# EAGLE design extruder-board (EAGLE 9.6.2)

## Sheet 1 of 2
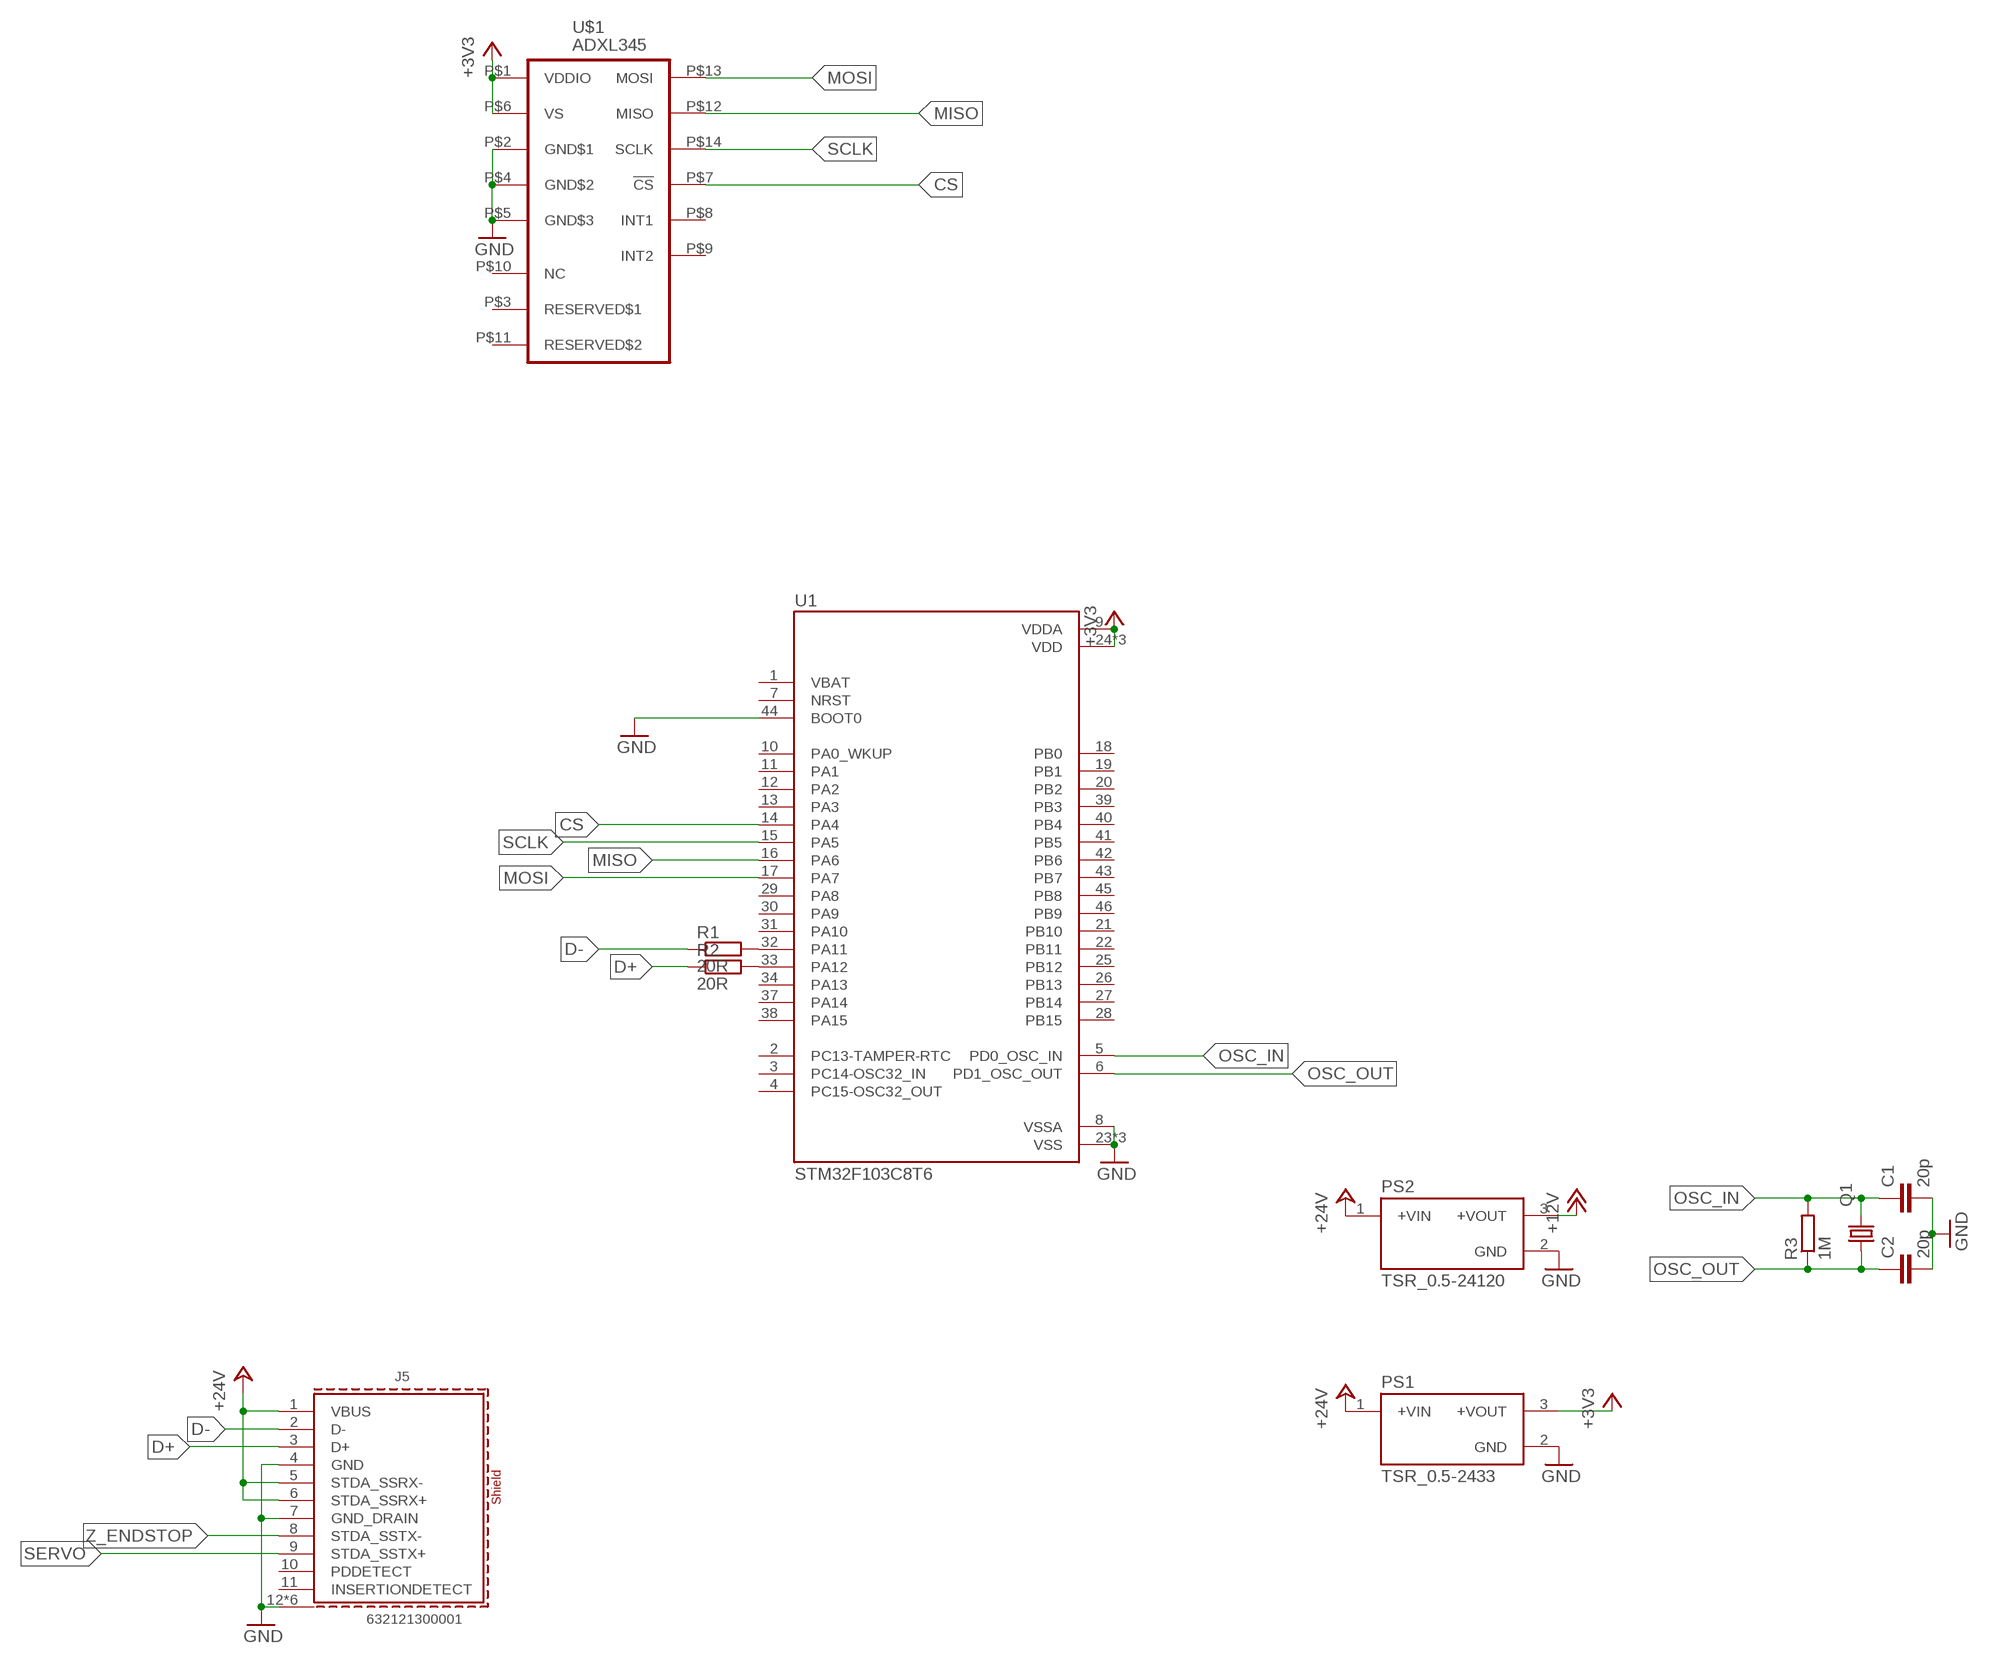
[diagram p0: schematic, sheet 1]

### Parts
C1  20p  C-EUC0805  [C0805]
C2  20p  C-EUC0805  [C0805]
J5  632121300001  [632121300001]
PS1  TSR_0.5-2433  [CONV_TSR_0.5-2433]
PS2  TSR_0.5-24120  TSR_0.5-2433  [CONV_TSR_0.5-2433]
Q1  KX-9A  [5.0X3.2_KX-9A]
R1  20R  R-EU_R0805  [R0805]
R2  20R  R-EU_R0805  [R0805]
R3  1M  R-EU_R0805  [R0805]
U1  STM32F103C8T6  [QFP50P900X900X160-48N]
U$1  ADXL345  [LGA14]

### Nets
+3V3: PS1.3(+VOUT) U1.9(VDDA) U1.24(VDD) U1.36(VDD) U1.48(VDD) U$1.P$1(VDDIO) U$1.P$6(VS)
+12V: PS2.3(+VOUT)
+24V: J5.1(VBUS) J5.5(STDA_SSRX-) J5.6(STDA_SSRX+) PS1.1(+VIN) PS2.1(+VIN)
CS: U1.14(PA4) U$1.P$7(!CS)
D+: J5.3(D+) R2.1
D-: J5.2(D-) R1.1
GND: C1.2 C2.2 J5.4(GND) J5.7(GND_DRAIN) J5.12(SHIELD) J5.13(SHIELD) J5.S1(SHIELD) J5.S2(SHIELD) J5.S3(SHIELD) J5.S4(SHIELD) PS1.2(GND) PS2.2(GND) U1.8(VSSA) U1.23(VSS) U1.35(VSS) U1.44(BOOT0) U1.47(VSS) U$1.P$2(GND$1) U$1.P$4(GND$2) U$1.P$5(GND$3)
MISO: U1.16(PA6) U$1.P$12(MISO)
MOSI: U1.17(PA7) U$1.P$13(MOSI)
N$1: R1.2 U1.32(PA11)
N$2: R2.2 U1.33(PA12)
OSC_IN: C1.1 Q1.3 R3.2 U1.5(PD0_OSC_IN)
OSC_OUT: C2.1 Q1.1 R3.1 U1.6(PD1_OSC_OUT)
SCLK: U1.15(PA5) U$1.P$14(SCLK)
SERVO: J5.9(STDA_SSTX+)
Z_ENDSTOP: J5.8(STDA_SSTX-)
Unconnected: J5.10(PDDETECT) J5.11(INSERTIONDETECT) U1.1(VBAT) U1.2(PC13-TAMPER-RTC) U1.3(PC14-OSC32_IN) U1.4(PC15-OSC32_OUT) U1.7(NRST) U1.10(PA0_WKUP) U1.11(PA1) U1.12(PA2) U1.13(PA3) U1.18(PB0) U1.19(PB1) U1.20(PB2) U1.21(PB10) U1.22(PB11) U1.25(PB12) U1.26(PB13) U1.27(PB14) U1.28(PB15) U1.29(PA8) U1.30(PA9) U1.31(PA10) U1.34(PA13) U1.37(PA14) U1.38(PA15) U1.39(PB3) U1.40(PB4) U1.41(PB5) U1.42(PB6) U1.43(PB7) U1.45(PB8) U1.46(PB9) U$1.P$3(RESERVED$1) U$1.P$8(INT1) U$1.P$9(INT2) U$1.P$10(NC) U$1.P$11(RESERVED$2)

## Sheet 2 of 2
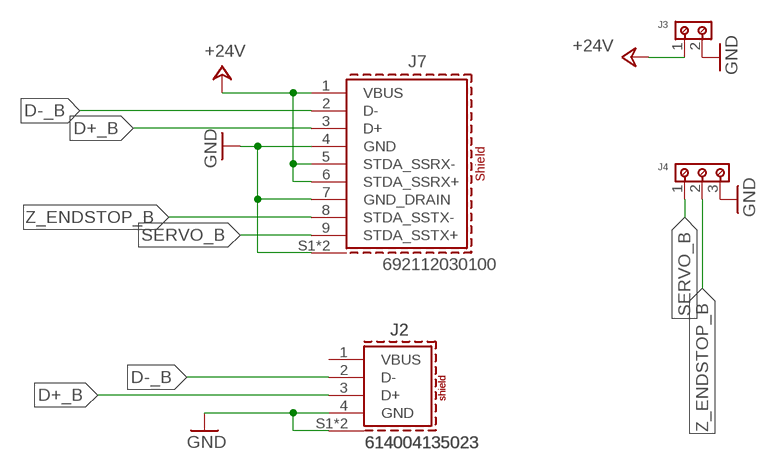
[diagram p1: schematic, sheet 2]

### Parts
J2  614004135023  [614004135023]
J3  691103110002  [691103110002]
J4  691103110003  [691103110003]
J7  692112030100  [692112030100]

### Nets
+24V_B: J3.1 J7.1(VBUS) J7.5(STDA_SSRX-) J7.6(STDA_SSRX+) ; supply symbol labelled +24V
D+_B: J2.3(D+) J7.3(D+)
D-_B: J2.2(D-) J7.2(D-)
GND_B: J2.4(GND) J2.S1(SHIELD) J2.S2(SHIELD) J3.2 J4.3 J7.4(GND) J7.7(GND_DRAIN) J7.S1(SHIELD) J7.S2(SHIELD) ; supply symbol labelled GND
SERVO_B: J4.1 J7.9(STDA_SSTX+)
Z_ENDSTOP_B: J4.2 J7.8(STDA_SSTX-)
Unconnected: J2.1(VBUS)

## Library data of the parts
C1 C2 = rcl:C-EU: CAPACITOR, European symbol; SPICEPREFIX: C
J2 = Eagle_WR-USB (rev21c):614004135023: WR-COM USB 2.0 Type A Vertical Kind Properties Durability:1500 Mating cycles Quality Class:1 500 Mating cycles Connector Type:USB Gender:Receptacle Type:Vertical General Information Operating Temperature:-40up to +105 °C Compliance:RoHS Electrical Properties IR 1:1.5 A Working Voltage:30V (AC) Withstanding Voltage:750V (AC) Contact Resistance:20 mΩ Material Properties Insulator Material:PBT Insulator Flammability Rating:UL94 V-0 Color:White Cover Material:Brass Cover Plating:Nickel Contact Material:Copper Alloy Contact Plating:Selective Gold Contact Type:Stamped Shielding Material:Brass Shielding Plating:Nickel <https://www.we-online.com/catalog/media/o32979v209%20Family_WR-COM_614004135023.jpg> Details see: https://www.we-online.com/catalog/en/COM_TYPE_A_VERTICAL/ Updated by Yingchun, Shan 2020-01-15 2020 (C) Würth Elektronik; APPLICATION: USB 2.0; DATASHEET-URL: https://www.we-online.com/catalog/datasheet/614004135023.pdf; GERDER: Receptacle; INTERFACE-TYPE: Type A; IR1: 1.5A; MOUNT: THT; PACKAGING: Tray; PART-NUMBER: 614004135023; PINS: 4; TYPE: Vertical; WORKING-VOLTAGE: 30V(AC)
J3 = Eagle_WR-TBL Wire Protector (rev20a):691103110002: WR-TBL Serie 1031 - 3.50 mm Horiz. Entry Modular KIND PROPERTIES Pitch 3.5 mm MATERIAL PROPERTIES Insulator Material PA66 Insulator Flammability Rating UL94 V-0 Insulator Color Blue Contact Material Brass Contact Plating Copper over Zinc Terminal Screw Material Steel Terminal Screw Plating Zinc Wire Guard Material Stainless Steel GENERAL INFORMATION Operating Temperature -40 up to +105 °C Compliance Lead free / RoHS ELECTRICAL PROPERTIES IR UL 10 A Working Voltage [UL] 125 V (AC) Withstanding Voltage [UL] 1250 V (AC) Contact Resistance 20 mΩ Contact Resistance [UL] 20 mΩ MECHANICAL PROPERTIES Wire Strip Length 5 up to 6 (mm) Screw M2 Solid Wire Section (AWG) 26 to 16 (AWG) Solid Wire Section (Metric) 0.129 to 1.31 (mm²) Stranded Wire Section (AWG) 26 to 16 (AWG) Stranded Wire Section (Metric) 0.129 to 1.31 (mm²) CERTIFICATION UL Approval E315414 PACKAGING PROPERTIES Packaging Box <https://katalog.we-online.com/media/images/v2/o33226v209%20Family_WR-TBL_69110311000x.jpg> Details see: https://katalog.we-online.com/en/em/TBL_3_50_1031_6911031100XX Updated by Ella Wu 2019-11-07 2019(C) Wurth Elektronik; DATASHEET-URL: https://www.we-online.com/catalog/datasheet/691103110002.pdf; IR-UL: 10A; MOUNT: THT; PART-NUMBER: 691103110002; PINS: 2; PITCH: 3.5mm; TYPE: Horizontal; WIRE: 26 to 16 (AWG) 0.129 to 1.31 (mm²); WORKING-VOLTAGE-UL: 125V(AC)
J4 = Eagle_WR-TBL Wire Protector (rev20a):691103110003: WR-TBL Serie 1031 - 3.50 mm Horiz. Entry Modular KIND PROPERTIES Pitch 3.5 mm MATERIAL PROPERTIES Insulator Material PA66 Insulator Flammability Rating UL94 V-0 Insulator Color Blue Contact Material Brass Contact Plating Copper over Zinc Terminal Screw Material Steel Terminal Screw Plating Zinc Wire Guard Material Stainless Steel GENERAL INFORMATION Operating Temperature -40 up to +105 °C Compliance Lead free / RoHS ELECTRICAL PROPERTIES IR UL 10 A Working Voltage [UL] 125 V (AC) Withstanding Voltage [UL] 1250 V (AC) Contact Resistance 20 mΩ Contact Resistance [UL] 20 mΩ MECHANICAL PROPERTIES Wire Strip Length 5 up to 6 (mm) Screw M2 Solid Wire Section (AWG) 26 to 16 (AWG) Solid Wire Section (Metric) 0.129 to 1.31 (mm²) Stranded Wire Section (AWG) 26 to 16 (AWG) Stranded Wire Section (Metric) 0.129 to 1.31 (mm²) CERTIFICATION UL Approval E315414 PACKAGING PROPERTIES Packaging Box <https://katalog.we-online.com/media/images/v2/o33226v209%20Family_WR-TBL_69110311000x.jpg> Details see: https://katalog.we-online.com/en/em/TBL_3_50_1031_6911031100XX Updated by Ella Wu 2019-11-07 2019(C) Wurth Elektronik; DATASHEET-URL: https://www.we-online.com/catalog/datasheet/691103110003.pdf; IR-UL: 10A; MOUNT: THT; PART-NUMBER: 691103110003; PINS: 3; PITCH: 3.5mm; TYPE: Horizontal; WIRE: 26 to 16 (AWG) 0.129 to 1.31 (mm²); WORKING-VOLTAGE-UL: 125V(AC)
J5 = Eagle_WR-USB (rev21c):632121300001: WR-COM USB 3.1 Type C Plug Horizontal 0.8 mm Kind Properties Durability:5 000 Mating cycles Quality Class:5 000 Mating cycles Connector Type:USB Gender:Receptacle Type:Horizontal General Information Operating Temperature:-20up to +85 °C Compliance:RoHS Electrical Properties IR 1:5A Working Voltage:20V (DC) Withstanding Voltage:100V (AC) Contact Resistance:50 mΩ Material Properties Insulator Material:PA9T Insulator Flammability Rating:UL94 V-0 Color:Blue Cover Material:Steel Cover Plating:Matte Tin Contact Material:Copper Alloy Contact Plating:Gold Contact Type:Stamped Shielding Material:Steel Shielding Plating:Matte Tin <https://www.we-online.com/catalog/media/o58978v209%20Family_WR-COM_632121300001_4C.jpg> Details see: https://www.we-online.com/catalog/en/COM_3_1_THT_TYPE_A_RECEPTACLE_HORIZONTAL/ Updated by Ella Wu 2020-08-17 2020 (C) Würth Elektronik; APPLICATION: USB 3.1; DATASHEET-URL: https://www.we-online.com/catalog/datasheet/632121300001.pdf; GERDER: Receptacle; INTERFACE-TYPE: Type A; IR1: 5A; MOUNT: THR; PACKAGING: Tray; PART-NUMBER: 632121300001; PINS: 9; TYPE: Horizontal; WORKING-VOLTAGE: 20V(DC)
J7 = Eagle_WR-USB (rev21c):692112030100: WR-COM USB 3.0 Type A SMT Plug with Clip Kind Properties Durability:5 000 Mating cycles Connector Type:USB Gender:Plug Type:Horizontal General Information Operating Temperature:-20up to +85 °C Compliance:RoHS Electrical Properties IR 1:1.8A Working Voltage:30V (AC) Withstanding Voltage:1000V (AC) Contact Resistance:50 mΩ Material Properties Insulator Material:LCP Insulator Flammability Rating:UL94 V-0 Color:Blue Contact Material:Phosphor Bronze Contact Plating:Matte Tin over Nickel Contact Type:Stamped Shielding Material:Steel Shielding Plating:Tin <https://www.we-online.com/catalog/media/o33019v209%20Family_WR-COM_692112030100.jpg> Details see: https://www.we-online.com/catalog/en/COM_3_0_SMT_TYPE_A_PLUG_WITH_CLIP/ Updated by Yingchun, Shan 2020-01-16 2020 (C) Würth Elektronik; APPLICATION: USB 3.0; DATASHEET-URL: https://www.we-online.com/catalog/datasheet/692112030100.pdf; GERDER: Plug; INTERFACE-TYPE: Type A; IR1: 1.8A; MOUNT: SMT; PACKAGING: Tray; PART-NUMBER: 692112030100; PINS: 9; TYPE: Horizontal; WORKING-VOLTAGE: 30V(AC)
PS1 PS2 = TSR_0.5-2433:TSR_0.5-2433: Check prices <https://pricing.snapeda.com/parts/TSR%200.5-2433/Traco%20Power/view-part?ref=eda>; AVAILABILITY: In Stock; DESCRIPTION: 0.5 Amp POL switching regulator, 4.75 to -32 VDC input, pos.-pos. circuit, LM78 compatible, SIP-3; MF: Traco Power; MP: TSR 0.5-2433; PACKAGE: SIP-3 Traco Power; PRICE: None; PURCHASE-URL: https://pricing.snapeda.com/search/part/TSR 0.5-2433/?ref=eda
Q1 = crystal-geyer_V1_0:KX: Quartz Crystals (MHz) SMD: KX - Serie Model Size l/w/h [mm] Frequency Range Frequency Stability Temp. Range [°C] Load Capacitance AECQ 200 availabel Datasheet KX-4 KX-5 KX-6 KX-7 KX-9A KX-9B KX-12A KX-12B KX-13 KX-20 KX-K KX-KS 1.6/1.2/0.3 2.0/1.6/0.45 2.5/2.0/0.55 3.2/2.5/0.8 5.0/3.2/1.0 5.0/3.2/1.1 6.0/3.5/1.1 6.0/3.5/1.0 7.0/5.0 /1.3 11.6/5.5/1.6 12.3/4.5/4.2 12.3/4.5/3.2 24.0 ~ 80.0 MHz 16.0 ~ 80.0 MHz 12.0 ~ 80.0 MHz 8.0 ~ 60.0 MHz 7,68 ~ 300,0 MHz 8,0 ~ 50,0 MHz 8,0 ~ 150,0 MHz 8,0 ~ 50,0 MHz 6,0 ~ 160,0 MHz 3,579 ~ 25,0 MHz 3,579 ~ 70,0 MHz 3,579 ~ 70,0 MHz ±10 … ±50ppm ±10 … ±50ppm ±10 … ±50ppm ±10 … ±50ppm ±10 … ±50ppm ±10 … ±50ppm ±10 … ±50ppm ±10 … ±50ppm ±10 … ±50ppm ±50ppm ±10 … ±50ppm ±10 … ±50ppm (*) -40°C …+85°C (*) -40°C …+125°C (*) -40°C …+125°C (*) -40°C …+125°C (*) -40°C …+105°C (*) -40°C …+105°C (*) -40°C …+125°C (*) -40°C …+105°C (*) -40°C …+105°C (*) -40°C …+105°C (*) -40°C …+85°C (*) -40°C …+85°C 8, 8…16 8, 8…16 10, 8…16 12, 7…20 16, 10…20 16, 10…20 16, 10…20 16, 12…20 16, 12…20 16, 12…20 16, 12…30 16, 12…30 - yes yes yes - - - - - - - - KX-4.pdf <http://www.geyer-electronic.de/uploads/tx_userartikelfrequenz/GEYER-KX-4.pdf> KX-5.pdf <http://www.geyer-electronic.de/uploads/tx_userartikelfrequenz/GEYER-KX-5.pdf> KX-6.pdf <http://www.geyer-electronic.de/uploads/tx_userartikelfrequenz/GEYER-KX-6.pdf> KX-7.pdf <http://www.geyer-electronic.de/uploads/tx_userartikelfrequenz/GEYER-KX-7.pdf> KX-9A.pdf <http://www.geyer-electronic.de/uploads/tx_userartikelfrequenz/GEYER-KX-9A.pdf> KX-9B.pdf <http://www.geyer-electronic.de/uploads/tx_userartikelfrequenz/GEYER-KX-9B.pdf> KX-12A.pdf <http://www.geyer-electronic.de/uploads/tx_userartikelfrequenz/GEYER-KX-12A.pdf> KX-12B.pdf <http://www.geyer-electronic.de/uploads/tx_userartikelfrequenz/GEYER-KX-12B.pdf> KX-13.pdf <http://www.geyer-electronic.de/uploads/tx_userartikelfrequenz/GEYER-KX-13.pdf> KX-20.pdf <http://www.geyer-electronic.de/uploads/tx_userartikelfrequenz/GEYER-KX-20.pdf> KX-K.pdf <http://www.geyer-electronic.de/uploads/tx_userartikelfrequenz/GEYER-KX-K.pdf> KX-KS.pdf <http://www.geyer-electronic.de/uploads/tx_userartikelfrequenz/GEYER-KX-KS.pdf> <http://www.geyer-electronic.de/fileadmin/template/img/logo-geyer-electronic.png> Details see: http://www.geyer-electronic.de/Frequenz-Produkte.9.0.html Created 2016-06-07, Hans Locher 2016 (C) Geyer Quartz Technology KX4,KX5,KX6,KX7,KX9A,KX9B,KX12A,KX12B,KX13,KX20,KXK,KXKS;1612;2016;2520;3225;5032;6035;7050;11655;12345;1,6x1,2;2,0x1,6;2,5x2,0;3,2x2,5;5,0x3,2;6,0x3,5;7,0x5,0;11,6x5,5;12,3x4,5;12,3x4,5;1.6x1.2;2.0x1.6;2.5x2.0;3.2x2.5;5.0x3.2;6.0x3.5;7.0x5.0;11.6x5.5;12.3x4.5;12.3x4.5;
R1-R3 = rcl:R-EU_: RESISTOR, European symbol; SPICEPREFIX: R
U1 = STM32F103C8T6:STM32F103C8T6: Mainstream Performance line, ARM Cortex-M3 MCU with 64 Kbytes Flash, 72 MHz CPU, motor control, USB and CAN Check prices <https://pricing.snapeda.com/parts/STM32F103C8T6/STMicroelectronics/view-part?ref=eda>; AVAILABILITY: In Stock; DESCRIPTION: ARM® Cortex®-M3 STM32F1 Microcontroller IC 32-Bit 72MHz 64KB (64K x 8) FLASH 48-LQFP (7x7); MF: STMicroelectronics; MP: STM32F103C8T6; PACKAGE: LQFP-48 STMicroelectronics; PRICE: None; PURCHASE-URL: https://pricing.snapeda.com/search/part/STM32F103C8T6/?ref=eda
U$1 = adxl345:ADXL345: 3-Axis, ±2 g/±4 g/±8 g/±16 g Digital Accelerometer

## Board
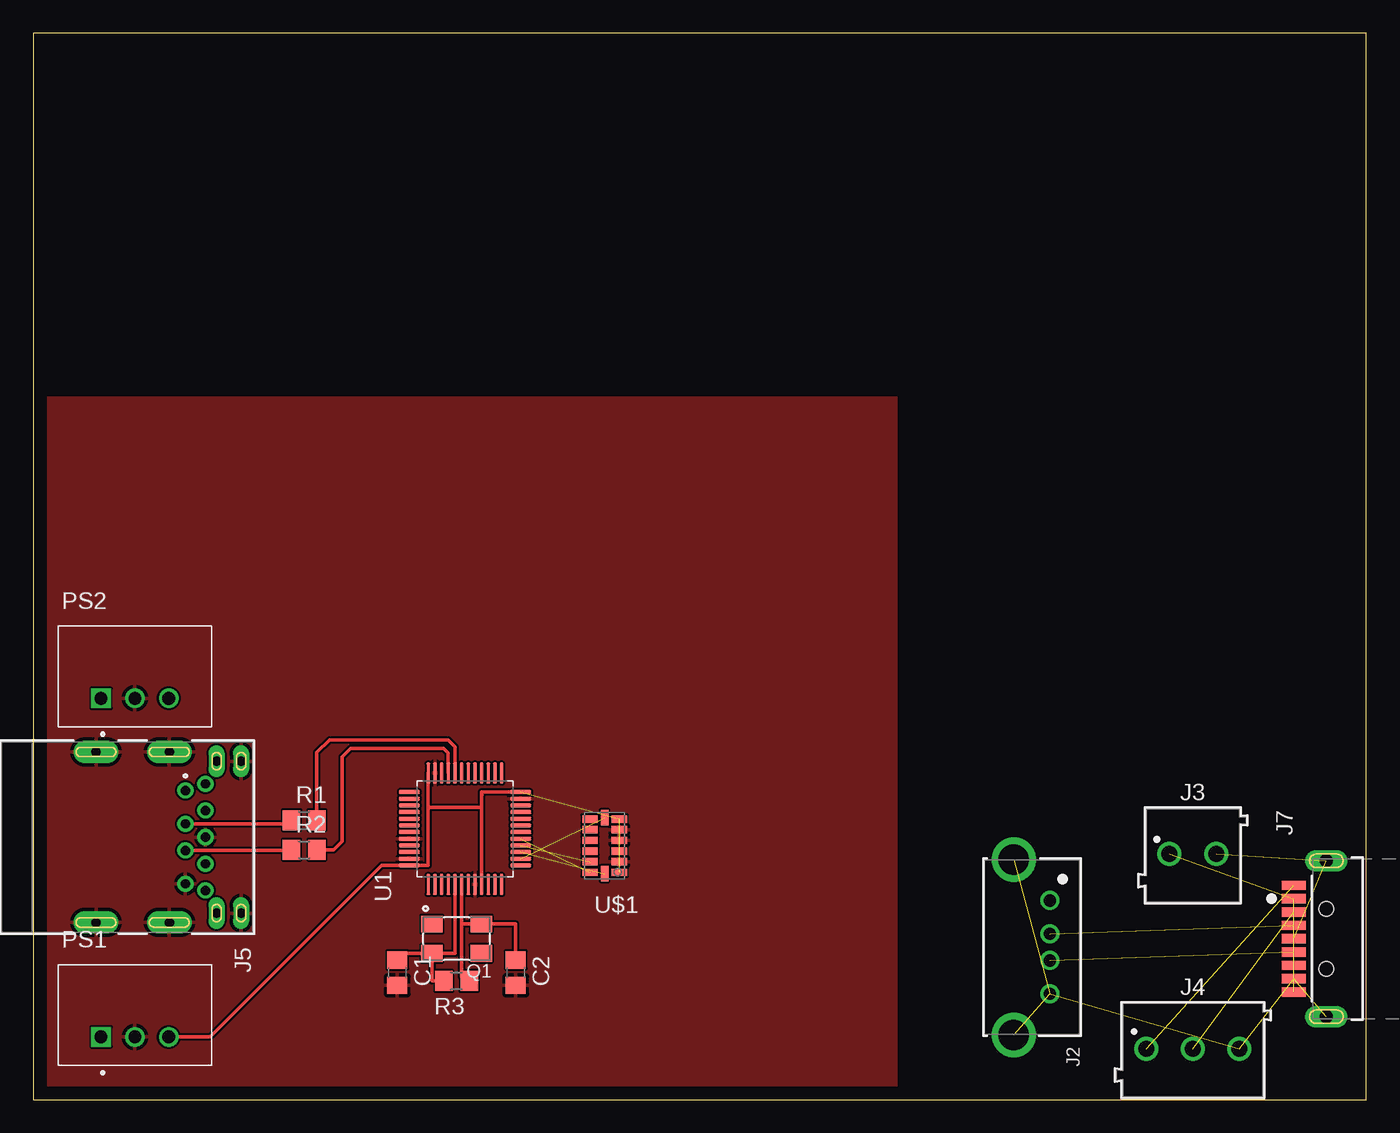
[diagram p2: board, top side]
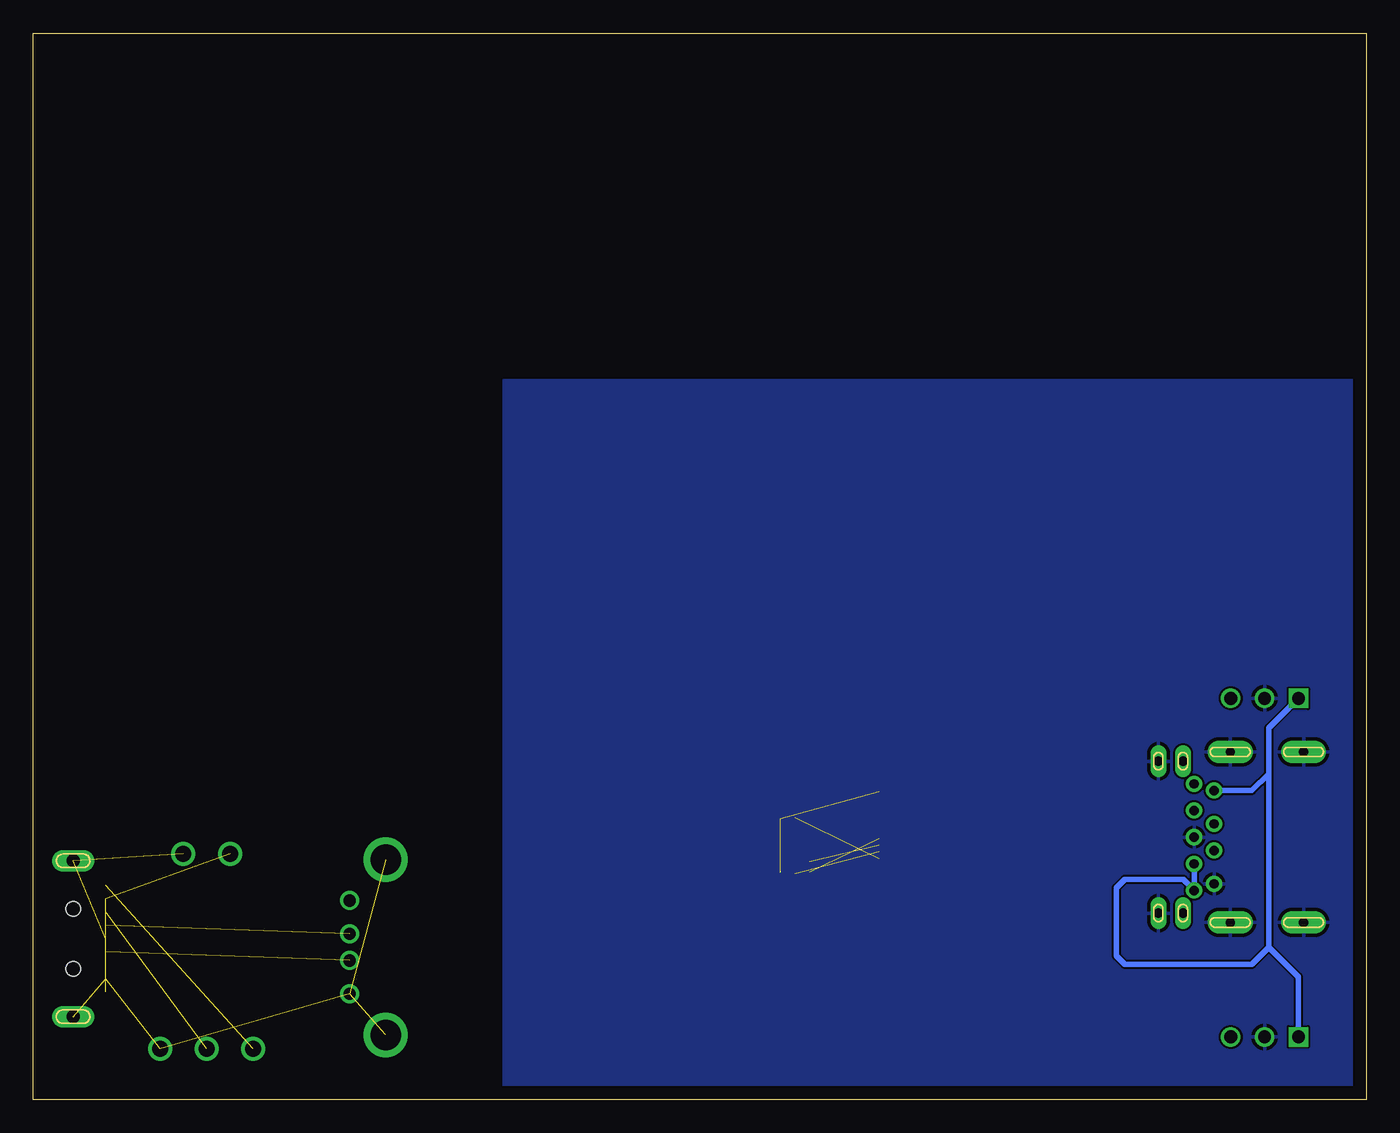
[diagram p3: board, bottom side, seen from below]

Size 100 x 80 mm. Coordinates in mm from the lower left corner, seen from the top.
Outline: 0,0 100,0 100,80 0,80 0,0
Copper layers (1*16): Top 0.035mm / dielectric 1.5mm / Bottom 0.035mm
Design rules "default": minimum track width 6mil, minimum drill 0.35mm, track to track 6mil, track to pad 6mil, pad to pad 6mil, via to via 6mil, smd to smd 6mil, copper to edge 40mil, drill to drill 6mil, minimum pad ring 10mil, minimum via ring 8mil, stop-mask expansion 4mil, vias tented up to drill 0mil, thermal gap 10mil

### Footprints (pad centres in the part's own frame; a part is rotated, then mirrored left to right if it is on the bottom)
C0805 = smd 1.3 x 1.5: 1 -0.95,0; 2 0.95,0
614004135023 = drill 0.92: 1 -3.5,1.34; 2 -1,1.34; 3 1,1.34; 4 3.5,1.34 | drill 2.3: S1 -6.57,-1.37; S2 6.59,-1.37
691103110002 = drill 1.2: 1 -1.75,0; 2 1.75,0
691103110003 = drill 1.2: 1 -3.5,0; 2 0,0; 3 3.5,0
632121300001 = drill 0.7 pad 1.1: 1 -3.5,4.425; 2 -1,4.425; 3 1,4.425; 4 3.5,4.425; 5 4,5.925; 6 2,5.925; 7 0,5.925; 8 -2,5.925; 9 -4,5.925 | drill 0.7 pad 1.1 long: 10 -5.7,6.765; 11 5.7,6.765; 12 5.7,8.605; 13 -5.7,8.605 | drill 0.7 pad 1.7 long: S1 -6.4,3.215; S2 6.4,3.215; S3 -6.4,-2.285; S4 6.4,-2.285
692112030100 = smd 0.7 x 1.8: 1 3,10.85; 2 1,10.85; 3 -1,10.85; 4 -3,10.85; 5 -4,10.85; 6 -2,10.85; 7 0,10.85; 8 2,10.85; 9 4,10.85 | drill 1 pad 1.6 long: S1 -5.85,8.4; S2 5.85,8.4 | hole 1.1: 2.25,8.4; -2.25,8.4
CONV_TSR_0.5-2433 = drill 0.96 square: 1 -2.54,-1.65 | drill 0.96: 2 0,-1.65; 3 2.54,-1.65
5.0X3.2_KX-9A = smd 1.6 x 1.25: 1 -1.85,-1.1; 2 1.85,-1.1; 3 1.85,1.1; 4 -1.85,1.1
R0805 = smd 1.3 x 1.5: 1 -0.95,0; 2 0.95,0
QFP50P900X900X160-48N = smd 1.56 x 0.28: 1 -4.18,2.75; 2 -4.18,2.25; 3 -4.18,1.75; 4 -4.18,1.25; 5 -4.18,0.75; 6 -4.18,0.25; 7 -4.18,-0.25; 8 -4.18,-0.75; 9 -4.18,-1.25; 10 -4.18,-1.75; 11 -4.18,-2.25; 12 -4.18,-2.75; 25 4.18,-2.75; 26 4.18,-2.25; 27 4.18,-1.75; 28 4.18,-1.25; 29 4.18,-0.75; 30 4.18,-0.25; 31 4.18,0.25; 32 4.18,0.75; 33 4.18,1.25; 34 4.18,1.75; 35 4.18,2.25; 36 4.18,2.75 | smd 0.28 x 1.56: 13 -2.75,-4.18; 14 -2.25,-4.18; 15 -1.75,-4.18; 16 -1.25,-4.18; 17 -0.75,-4.18; 18 -0.25,-4.18; 19 0.25,-4.18; 20 0.75,-4.18; 21 1.25,-4.18; 22 1.75,-4.18; 23 2.25,-4.18; 24 2.75,-4.18; 37 2.75,4.18; 38 2.25,4.18; 39 1.75,4.18; 40 1.25,4.18; 41 0.75,4.18; 42 0.25,4.18; 43 -0.25,4.18; 44 -0.75,4.18; 45 -1.25,4.18; 46 -1.75,4.18; 47 -2.25,4.18; 48 -2.75,4.18
LGA14 = smd 1.15 x 0.55: P$1 -1.1,2; P$2 -1.1,1.2; P$3 -1.1,0.4; P$4 -1.1,-0.4; P$5 -1.1,-1.2; P$6 -1.1,-2; P$8 1.1,-2; P$9 1.1,-1.2; P$10 1.1,-0.4; P$11 1.1,0.4; P$12 1.1,1.2; P$13 1.1,2 | smd 0.55 x 1.15: P$7 0,-2.1; P$14 0,2.1

### Placement (x,y rotation side)
C1  27.3,9.53 270 top
C2  36.2,9.53 270 top
J2  74.93,11.43 270 top
J3  87,18.41 0 top
J4  87,3.81 0 top
J5  6.99,19.68 270 top
J7  105.41,12.06 90 top
PS1  7.62,6.35 0 top
PS2  7.62,31.75 0 top
Q1  31.75,12.06 180 top
R1  20.32,20.95 0 top
R2  20.32,18.73 0 top
R3  31.75,8.89 180 top
U1  32.38,20.32 90 top
U$1  42.86,19.05 180 top

### Tracks (layer width: path | path; a pad name or v marks a point on that pad's centre or on a via)
+3V3  (2 unrouted)
  Top 0.254: PS1.3 13.27,4.7 26.14,17.57 U1.48 29.64,17.57 29.64,21.91 | U1.36 29.64,21.91 | U1.9 33.63,21.91 | 33.63,22.86 33.66,22.86 | U1.24 33.63,23.07 33.63,22.86 | 33.63,22.86 33.63,21.91 | 33.63,21.91 29.64,21.91
+24V
  Bottom 0.406: J5.1 8.56,23.18 7.3,24.45 | PS2.1 7.3,27.88 7.3,24.45 | 7.3,11.43 7.3,24.45 | 7.3,11.43 8.57,10.16 18.1,10.16 18.73,10.79 18.73,15.88 18.1,16.51 13.73,16.51 J5.5 J5.6 | PS1.1 5.08,9.21 7.3,11.43
+24V_B  (3 unrouted)
CS  (1 unrouted)
D+
  Top 0.254: 19.32,18.68 R2.1 | R2.1 | R2.1 19.37,18.68 J5.3
D+_B  (1 unrouted)
D-
  Top 0.254: J5.2 19.1,20.68 R1.1
D-_B  (1 unrouted)
GND
  pour Top: -0.64,52.7 64.77,52.7 64.77,-1.27 -0.64,-1.27
  pour Bottom: -0.64,53.98 64.77,53.98 64.77,-1.91 -0.64,-1.91
GND_B  (8 unrouted)
MISO  (1 unrouted)
MOSI  (1 unrouted)
N$1
  Top 0.254: U1.32 31.64,26.47 31.11,26.99 22.23,26.99 21.27,26.03 R1.2
N$2
  Top 0.254: U1.33 31.14,26.02 30.8,26.35 23.81,26.35 23.18,25.72 23.18,19.37 22.54,18.73 R2.2
OSC_IN
  Top 0.254: U1.5 31.64,10.96 Q1.3 | Q1.3 27.3,10.96 C1.1 | R3.2 29.9,8.89 Q1.3
OSC_OUT
  Top 0.254: U1.6 32.13,13.34 32.13,13.16 | 32.13,13.16 Q1.1 36.2,13.16 C2.1 | R3.1 32.7,9.21 32.13,9.21 32.13,13.16
SCLK  (1 unrouted)
SERVO_B  (1 unrouted)
Z_ENDSTOP_B  (1 unrouted)